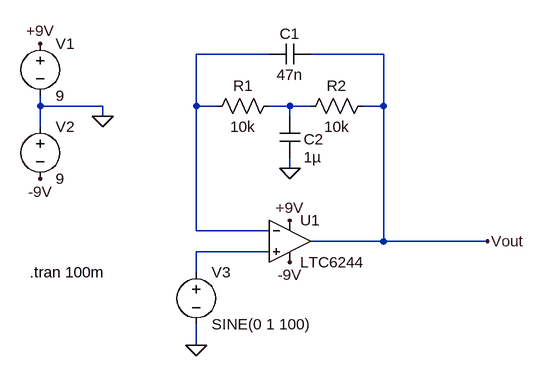
[diagram p0: schematic Bridged_T_Peak_Filter_Tran.asc]
Bridged_T_Peak_Filter_Tran.asc, the LTspice schematic file:
Version 4
SHEET 1 1712 1132
WIRE 912 -96 800 -96
WIRE 1088 -96 976 -96
WIRE 560 -16 560 -32
WIRE 656 -16 560 -16
WIRE 800 -16 800 -96
WIRE 832 -16 800 -16
WIRE 944 -16 912 -16
WIRE 976 -16 944 -16
WIRE 1088 -16 1088 -96
WIRE 1088 -16 1056 -16
WIRE 656 0 656 -16
WIRE 944 0 944 -16
WIRE 560 16 560 -16
WIRE 944 80 944 64
WIRE 800 176 800 -16
WIRE 912 176 800 176
WIRE 1088 192 1088 -16
WIRE 1088 192 976 192
WIRE 1248 192 1088 192
WIRE 912 208 800 208
WIRE 800 240 800 208
WIRE 800 352 800 320
FLAG 1248 192 Vout
FLAG 656 0 0
FLAG 560 -112 +9V
FLAG 560 96 -9V
FLAG 944 224 -9V
FLAG 944 160 +9V
FLAG 944 80 0
FLAG 800 352 0
SYMBOL res 928 -32 R90
WINDOW 0 0 56 VBottom 2
WINDOW 3 32 56 VTop 2
SYMATTR InstName R1
SYMATTR Value 10k
SYMBOL res 1072 -32 R90
WINDOW 0 0 56 VBottom 2
WINDOW 3 32 56 VTop 2
SYMATTR InstName R2
SYMATTR Value 10k
SYMBOL voltage 560 -128 R0
SYMATTR InstName V1
SYMATTR Value 9
SYMBOL voltage 560 0 R0
SYMATTR InstName V2
SYMATTR Value 9
SYMBOL cap 976 -112 R90
WINDOW 0 0 32 VBottom 2
WINDOW 3 32 32 VTop 2
SYMATTR InstName C1
SYMATTR Value 47n
SYMATTR SpiceLine mfg="   ---" pn="   ---" type="   ---"
SYMBOL cap 960 64 R180
WINDOW 0 -36 29 Left 2
WINDOW 3 -32 1 Left 2
SYMATTR InstName C2
SYMATTR Value 1µ
SYMATTR SpiceLine mfg="   ---" pn="   ---" type="   ---"
SYMBOL Opamps/LTC6244 944 192 R0
SYMATTR InstName U1
SYMBOL voltage 800 224 R0
SYMATTR InstName V3
SYMATTR Value SINE(0 1 100)
SYMATTR Value2 AC 1
TEXT 544 240 Left 2 !.tran 100m

The netlist it stands for:
* Bridged_T_Peak_Filter_Tran.asc
R1 N002 N001 10k
R2 Vout N002 10k
V1 +9V 0 9
V2 0 -9V 9
C1 Vout N001 47n mfg="   ---" pn="   ---" type="   ---"
C2 0 N002 1µ mfg="   ---" pn="   ---" type="   ---"
XU1 N003 N001 +9V -9V Vout LTC6244  ; pins In+ In- V+ V- OUT
V3 N003 0 SINE(0 1 100) AC 1
.tran 100m
.backanno
.end